# EAGLE design Driver (EAGLE 6.4)
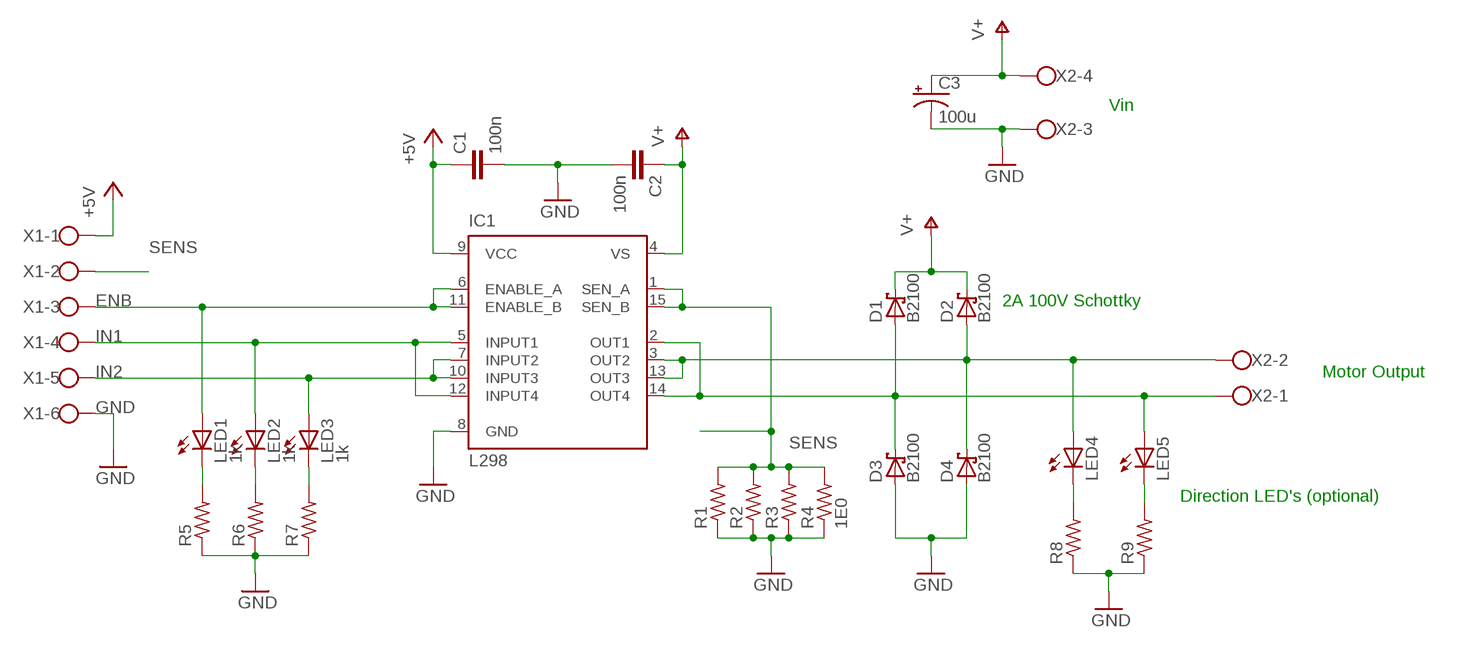
[diagram p0: schematic, sheet 1]

## Parts
C1  100n  C-EUC0805K  [C0805K]
C2  100n  C-EUC0805K  [C0805K]
C3  100u  CPOL-USE7.5-16  [E7,5-16]
D1  B2100  MBRS340T3  [SMC]
D2  B2100  MBRS340T3  [SMC]
D3  B2100  MBRS340T3  [SMC]
D4  B2100  MBRS340T3  [SMC]
IC1  L298  [MULTIWATT-15]
LED1  1k  LED3MM  [LED3MM]
LED2  1k  LED3MM  [LED3MM]
LED3  1k  LED3MM  [LED3MM]
LED4  LED3MM  [LED3MM]
LED5  LED3MM  [LED3MM]
R1  R-US_R2512  [R2512]
R2  R-US_R2512  [R2512]
R3  R-US_R2512  [R2512]
R4  1E0  R-US_R2512  [R2512]
R5  R-US_R0805  [R0805]
R6  R-US_R0805  [R0805]
R7  R-US_R0805  [R0805]
R8  R-US_R0805  [R0805]
R9  R-US_R0805  [R0805]
X1  W237-6  [W237-6]
X2  W237-4  [W237-4]

## Nets
+5V: C1.1 IC1.9(VCC) X1.1
ENB: IC1.6(ENABLE_A) IC1.11(ENABLE_B) LED1.A X1.3
GND: C1.2 C2.2 C3.- D3.A D4.A IC1.8(GND) R1.1 R2.1 R3.1 R4.1 R5.1 R6.1 R7.1 R8.1 R9.1 X1.6 X2.3
IN1: IC1.5(INPUT1) IC1.12(INPUT4) LED2.A X1.4
IN2: IC1.7(INPUT2) IC1.10(INPUT3) LED3.A X1.5
N$1: LED4.K(C) R8.2
N$2: LED5.K(C) R9.2
N$3: LED1.K(C) R5.2
N$4: LED2.K(C) R6.2
N$5: LED3.K(C) R7.2
OUT1: D1.A D3.C IC1.2(OUT1) IC1.14(OUT4) LED5.A X2.1
OUT2: D2.A D4.C IC1.3(OUT2) IC1.13(OUT3) LED4.A X2.2
SENS: IC1.1(SEN_A) IC1.15(SEN_B) R1.2 R2.2 R3.2 R4.2 X1.2
V+: C2.1 C3.+ D1.C D2.C IC1.4(VS) X2.4

## Notes on the sheet
- Vin
- 2A 100V Schottky
- Motor Output
- Direction LED's (optional)

## Library data of the parts
C1 C2 = resistor:C-EU: CAPACITOR, European symbol
C3 = resistor:CPOL-US: POLARIZED CAPACITOR, American symbol
D1-D4 = diode:MBRS3*0T3: SCHOTTKY BARRIER RECTIFIER 3.0 AMPERES 20, 30, 40 VOLT Source: MBRS340T3-D.pdf
IC1 = st-microelectronics:L298: DUAL FULL-BRIDGE DRIVER; MPN: L298N; OC_FARNELL: 1589425; OC_NEWARK: 32M1527
LED1-LED5 = led:LED: LED OSRAM: - CHIPLED LG R971, LG N971, LY N971, LG Q971, LY Q971, LO R971, LY R971 LH N974, LH R974 LS Q976, LO Q976, LY Q976 LO Q996 - Hyper CHIPLED LW Q18S LB Q993, LB Q99A, LB R99A - SideLED LS A670, LO A670, LY A670, LG A670, LP A670 LB A673, LV A673, LT A673, LW A673 LH A674 LY A675 LS A676, LA A676, LO A676, LY A676, LW A676 LS A679, LY A679, LG A679 - Hyper Micro SIDELED® LS Y876, LA Y876, LO Y876, LY Y876 LT Y87S - SmartLED LW L88C, LW L88S LB L89C, LB L89S, LG L890 LS L89K, LO L89K, LY L89K LS L896, LA L896, LO L896, LY L896 - TOPLED LS T670, LO T670, LY T670, LG T670, LP T670 LSG T670, LSP T670, LSY T670, LOP T670, LYG T670 LG T671, LOG T671, LSG T671 LB T673, LV T673, LT T673, LW T673 LH T674 LS T676, LA T676, LO T676, LY T676, LB T676, LH T676, LSB T676, LW T676 LB T67C, LV T67C, LT T67C, LS T67K, LO T67K, LY T67K, LW E67C LS E67B, LA E67B, LO E67B, LY E67B, LB E67C, LV E67C, LT E67C LW T67C LS T679, LY T679, LG T679 LS T770, LO T770, LY T770, LG T770, LP T770 LB T773, LV T773, LT T773, LW T773 LH T774 LS E675, LA E675, LY E675, LS T675 LS T776, LA T776, LO T776, LY T776, LB T776 LHGB T686 LT T68C, LB T68C - Hyper Mini TOPLED® LB M676 - Mini TOPLED Santana® LG M470 LS M47K, LO M47K, LY M47K Source: http://www.osram.convergy.de LUXEON: - LUMILED® LXK2-PW12-R00, LXK2-PW12-S00, LXK2-PW14-U00, LXK2-PW14-V00 LXK2-PM12-R00, LXK2-PM12-S00, LXK2-PM14-U00 LXK2-PE12-Q00, LXK2-PE12-R00, LXK2-PE12-S00, LXK2-PE14-T00, LXK2-PE14-U00 LXK2-PB12-K00, LXK2-PB12-L00, LXK2-PB12-M00, LXK2-PB14-N00, LXK2-PB14-P00, LXK2-PB14-Q00 LXK2-PR12-L00, LXK2-PR12-M00, LXK2-PR14-Q00, LXK2-PR14-R00 LXK2-PD12-Q00, LXK2-PD12-R00, LXK2-PD12-S00 LXK2-PH12-R00, LXK2-PH12-S00 LXK2-PL12-P00, LXK2-PL12-Q00, LXK2-PL12-R00 Source: www.luxeon.com KINGBRIGHT: KA-3528ASYC Source: www.kingbright.com
R1-R9 = resistor:R-US_: RESISTOR, American symbol
X1 = con-wago-500:W237-6: WAGO SCREW CLAMP; OC_FARNELL: unknown; OC_NEWARK: unknown
X2 = con-wago-500:W237-4: WAGO SCREW CLAMP; OC_FARNELL: unknown; OC_NEWARK: unknown

## Board
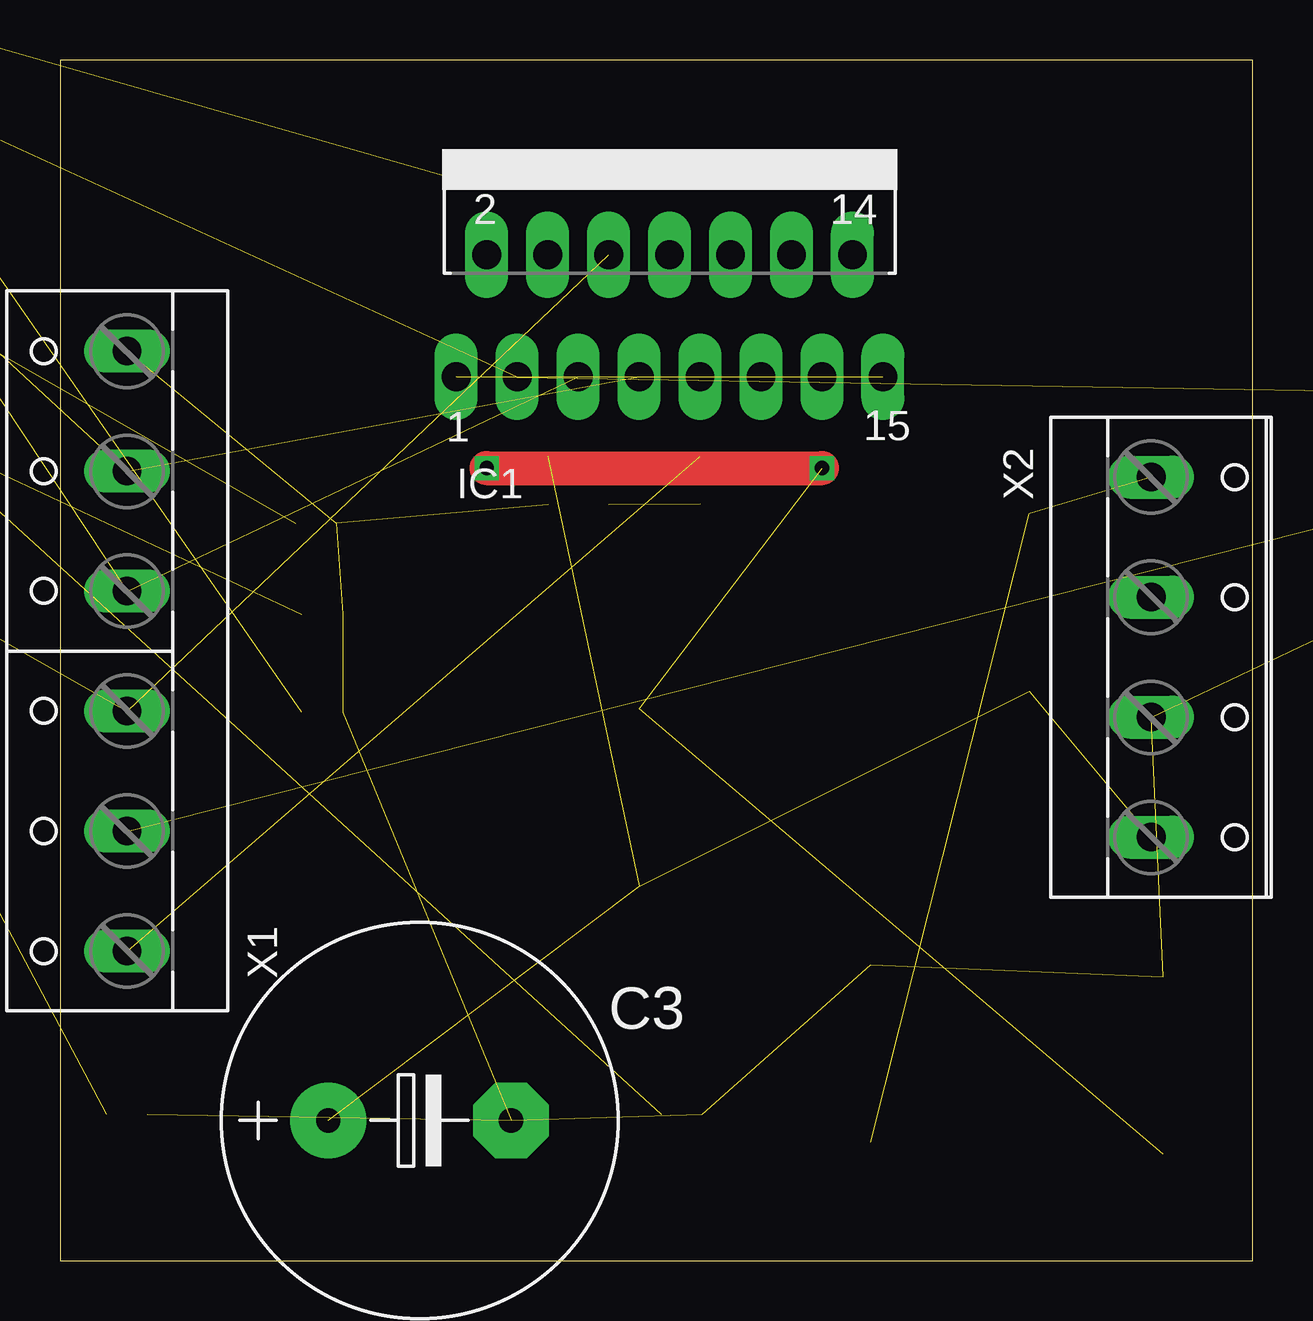
[diagram p1: board, top side]
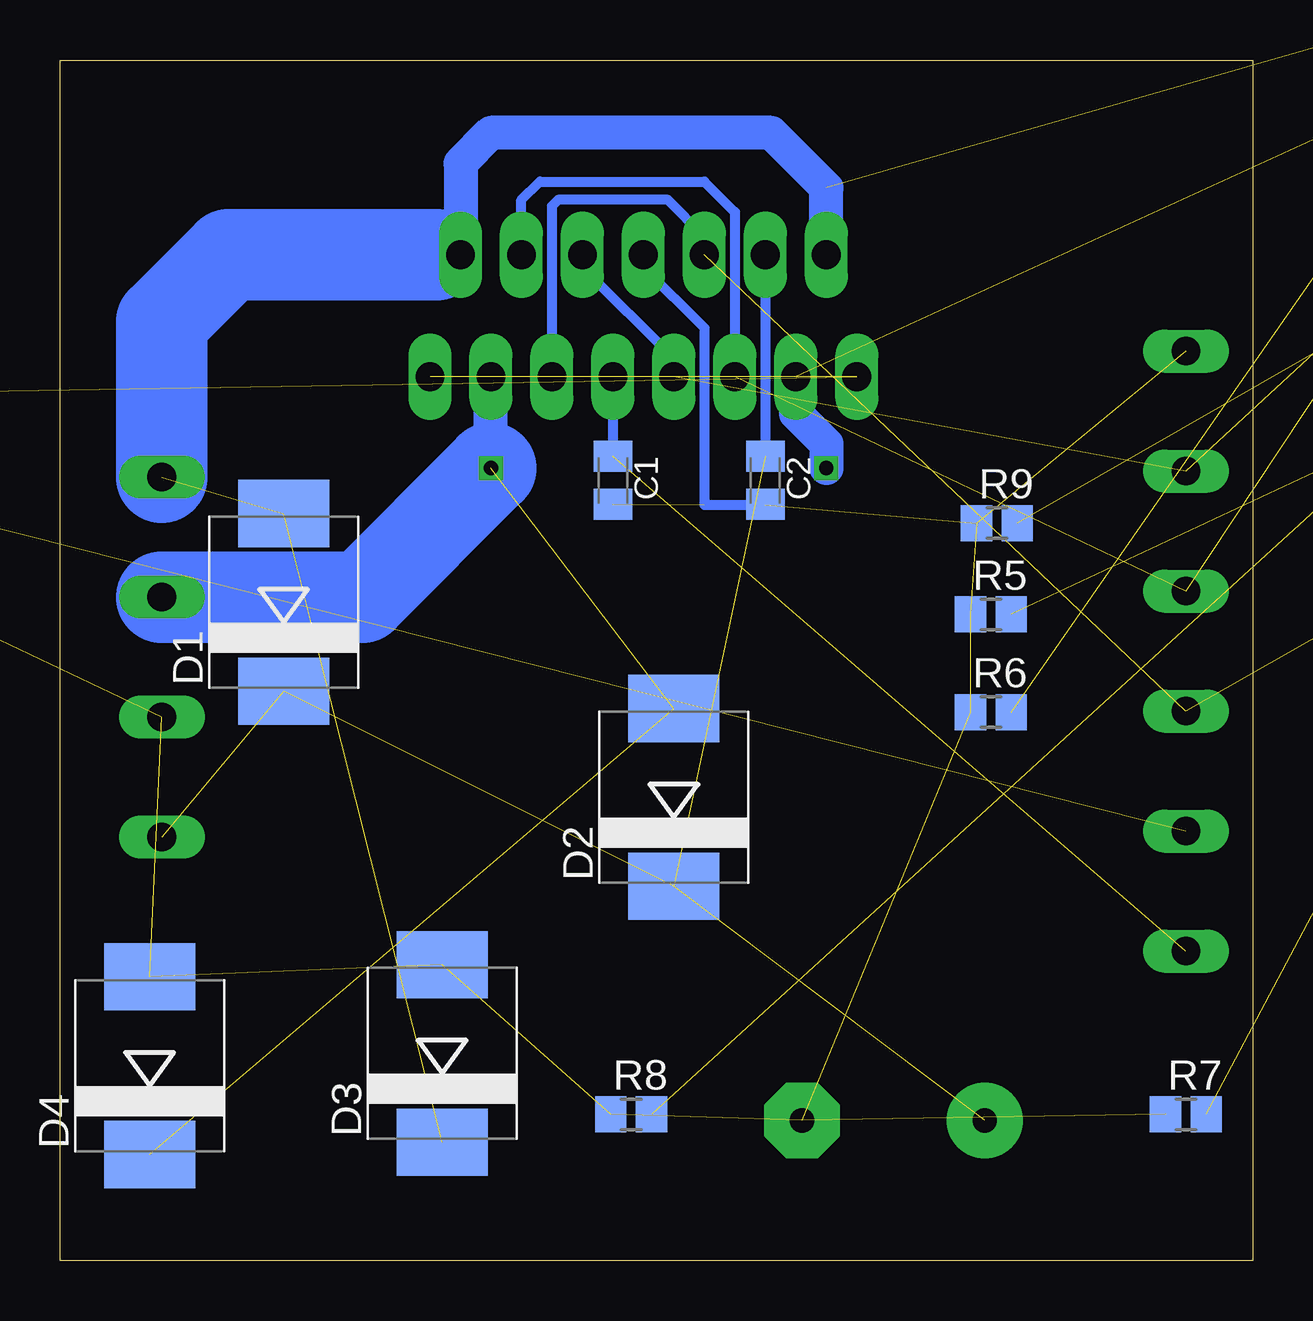
[diagram p2: board, bottom side, seen from below]

Size 49.71 x 50.03 mm. Coordinates in mm from the lower left corner, seen from the top.
Outline: 0,0 49.71,0 49.71,50.03 0,50.03 0,0
Copper layers (1*16): Top 0.035mm / dielectric 1.5mm / Bottom 0.035mm
Design rules "default": minimum track width 10mil, minimum drill 24mil, track to track 8mil, track to pad 8mil, pad to pad 8mil, via to via 8mil, smd to smd 8mil, copper to edge 40mil, drill to drill 8mil, minimum pad ring 10mil, minimum via ring 8mil, stop-mask expansion 4mil, vias tented up to drill 0mil, thermal gap 10mil

### Footprints (pad centres in the part's own frame; a part is rotated, then mirrored left to right if it is on the bottom)
C0805K = smd 1.3 x 1.6: 1 -1,0; 2 1,0
E7,5-16 = drill 1.016 pad 3.15: + -3.81,0 | drill 1.016 pad 3.15 octagon: - 3.81,0
SMC = smd 2.8 x 3.8: A 3.7,0; C -3.7,0
MULTIWATT-15 = drill 1.2 long: 1 -8.89,-7.62; 2 -7.62,-2.54; 3 -6.35,-7.62; 4 -5.08,-2.54; 5 -3.81,-7.62; 6 -2.54,-2.54; 7 -1.27,-7.62; 8 0,-2.54; 9 1.27,-7.62; 10 2.54,-2.54; 11 3.81,-7.62; 12 5.08,-2.54; 13 6.35,-7.62; 14 7.62,-2.54; 15 8.89,-7.62
LED3MM = drill 0.813 octagon: A -1.27,0; K 1.27,0
R2512 = smd 1.8 x 3.2: 1 -2.8,0; 2 2.8,0
R0805 = smd 1.3 x 1.5: 1 -0.85,0; 2 0.85,0
W237-6 = drill 1.194 long: 1 -12.5,-1.27; 2 -7.5,-1.27; 3 -2.5,-1.27; 4 2.5,-1.27; 5 7.5,-1.27; 6 12.5,-1.27
W237-4 = drill 1.194 long: 1 -7.5,-1.27; 2 -2.5,-1.27; 3 2.5,-1.27; 4 7.5,-1.27

### Placement (x,y rotation side)
C1  26.67,32.51 270 bottom
C2  20.32,32.51 270 bottom
C3  14.99,5.84 0 top
D1  40.39,27.43 90 bottom
D2  24.13,19.3 90 bottom
D3  33.78,8.64 90 bottom
D4  45.97,8.13 90 bottom
IC1  25.4,44.45 0 top
LED1  -58.42,58.42 0 top  (outside the outline)
LED2  -20.32,64.77 0 top  (outside the outline)
LED3  -30.48,64.77 0 top  (outside the outline)
LED4  -40.64,64.77 0 top  (outside the outline)
LED5  -50.8,64.77 0 top  (outside the outline)
R1  74.17,33.27 90 bottom  (outside the outline)
R2  70.1,33.27 90 bottom  (outside the outline)
R3  66.04,33.27 90 bottom  (outside the outline)
R4  61.98,33.27 90 bottom  (outside the outline)
R5  10.92,26.92 0 bottom
R6  10.92,22.86 0 bottom
R7  2.79,6.1 0 bottom
R8  25.91,6.1 0 bottom
R9  10.67,30.73 0 bottom
X1  1.52,25.4 90 top
X2  46.74,25.15 270 top

### Tracks (layer width: path | path; a pad name or v marks a point on that pad's centre or on a via)
+5V  (1 unrouted)
  Bottom 0.406: IC1.9 C1.1
ENB  (2 unrouted)
  Bottom 0.406: IC1.6 22.86,42.67 24.38,44.2 28.96,44.2 29.21,43.94 IC1.11
GND  (15 unrouted)
  Bottom 0.406: IC1.8 25.4,41.4 22.86,38.86 22.86,31.5 20.34,31.5 C2.2
IN1  (2 unrouted)
  Bottom 0.406: IC1.12 30.48,44.2 29.72,44.96 22.86,44.96 21.59,43.69 IC1.5
IN2  (2 unrouted)
  Bottom 0.406: IC1.10 27.94,41.4 24.13,37.59 IC1.7
N$1  (1 unrouted)
N$2  (1 unrouted)
N$3  (1 unrouted)
N$4  (1 unrouted)
N$5  (1 unrouted)
OUT1  (3 unrouted)
  Bottom 1.422: IC1.2 17.78,44.7 20.07,46.99 31.75,46.99 33.02,45.72 IC1.14 34.04,41.91
  Bottom 3.81: X2.1 45.47,39.12 42.67,41.91 34.04,41.91
OUT2  (via drill 0.6)  (3 unrouted)
  Top 1.422: v17.78,33.02 v31.75,33.02
  Bottom 1.422: IC1.3 19.05,35.31 17.78,34.04 v17.78,33.02 | v31.75,33.02 IC1.13
  Bottom 3.81: X2.2 37.12,27.65 v31.75,33.02
SENS  (6 unrouted)
V+  (4 unrouted)
  Bottom 0.406: IC1.4 C2.1